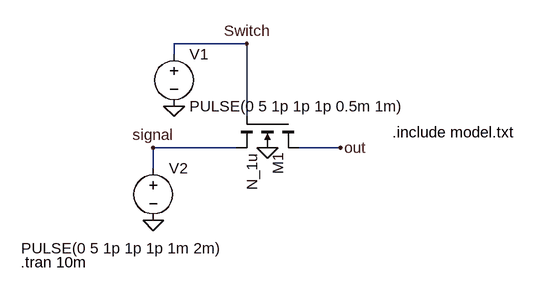
[diagram p0: schematic without res.asc]
without res.asc, the LTspice schematic file:
Version 4
SHEET 1 880 680
WIRE 208 0 96 0
WIRE 96 16 96 0
WIRE 208 112 208 0
WIRE 192 160 64 160
WIRE 352 160 288 160
WIRE 64 192 64 160
FLAG 240 160 0
FLAG 96 96 0
FLAG 64 272 0
FLAG 208 0 Switch
FLAG 64 160 signal
FLAG 352 160 out
SYMBOL nmos4 288 112 R90
SYMATTR InstName M1
SYMATTR Value N_1u
SYMATTR Value2 l=0.9u w=1.8u
SYMBOL voltage 96 0 R0
WINDOW 123 0 0 Left 0
WINDOW 39 0 0 Left 0
SYMATTR InstName V1
SYMATTR Value PULSE(0 5 1p 1p 1p 0.5m 1m)
SYMBOL voltage 64 176 R0
WINDOW 3 -203 139 Left 2
WINDOW 123 0 0 Left 0
WINDOW 39 0 0 Left 0
SYMATTR Value PULSE(0 5 1p 1p 1p 1m 2m)
SYMATTR InstName V2
TEXT 432 136 Left 2 !.include model.txt
TEXT -140 336 Left 2 !.tran 10m

The netlist it stands for:
* without res.asc
M1 out Switch signal 0 N_1u l=0.9u w=1.8u
V1 Switch 0 PULSE(0 5 1p 1p 1p 0.5m 1m)
V2 signal 0 PULSE(0 5 1p 1p 1p 1m 2m)
.model NMOS NMOS
.model PMOS PMOS
.lib standard.mos
.include model.txt
.tran 10m
.backanno
.end